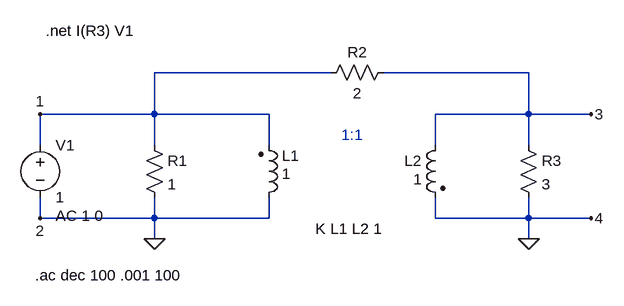
[diagram p0: schematic TS6_1.asc]
TS6_1.asc, the LTspice schematic file:
Version 4
SHEET 1 896 680
WIRE 464 32 192 32
WIRE 768 32 544 32
WIRE 192 96 192 32
WIRE 192 96 16 96
WIRE 368 96 192 96
WIRE 768 96 768 32
WIRE 768 96 624 96
WIRE 864 96 768 96
WIRE 16 144 16 96
WIRE 192 144 192 96
WIRE 368 144 368 96
WIRE 624 144 624 96
WIRE 768 144 768 96
WIRE 16 256 16 224
WIRE 192 256 192 224
WIRE 192 256 16 256
WIRE 368 256 368 224
WIRE 368 256 192 256
WIRE 624 256 624 224
WIRE 768 256 768 224
WIRE 768 256 624 256
WIRE 864 256 768 256
WIRE 192 288 192 256
WIRE 768 288 768 256
FLAG 16 96 1
FLAG 16 256 2
FLAG 864 96 3
FLAG 864 256 4
FLAG 192 288 0
FLAG 768 288 0
SYMBOL voltage 16 128 R0
WINDOW 123 24 124 Left 2
WINDOW 39 0 0 Left 0
SYMATTR Value2 AC 1 0
SYMATTR InstName V1
SYMATTR Value 1
SYMBOL res 176 128 R0
SYMATTR InstName R1
SYMATTR Value 1
SYMBOL res 560 16 R90
WINDOW 0 0 56 VBottom 2
WINDOW 3 32 56 VTop 2
SYMATTR InstName R2
SYMATTR Value 2
SYMBOL ind2 352 240 M180
WINDOW 0 36 80 Left 2
WINDOW 3 36 52 Left 2
SYMATTR InstName L1
SYMATTR Value 1
SYMBOL ind2 640 128 M0
WINDOW 3 36 68 Left 2
SYMATTR Value 1
SYMATTR InstName L2
SYMBOL res 752 128 R0
SYMATTR InstName R3
SYMATTR Value 3
TEXT 440 272 Left 2 !K L1 L2 1
TEXT 480 128 Left 2 ;1:1
TEXT 24 -32 Left 2 !.net I(R3) V1
TEXT 8 344 Left 2 !.ac dec 100 .001 100

The netlist it stands for:
* TS6_1.asc
V1 1 0 1 AC 1 0
R1 1 0 1
R2 3 1 2
L1 0 1 1
L2 3 0 1
R3 3 0 3
K L1 L2 1
* 1:1
.net I(R3) V1
.ac dec 100 .001 100
.backanno
.end